# EAGLE schematic rockshield-standard (EAGLE 5.02)
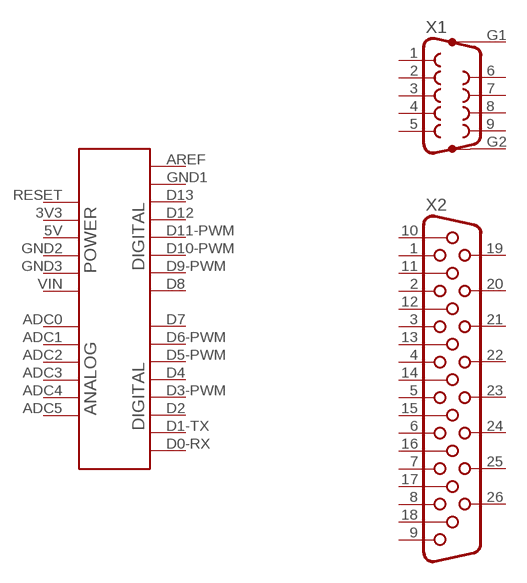
[diagram p0: schematic, sheet 1]

## Parts
U$1  2009  [2009]
X1  F09HP  [F09HP]
X2  HF26H  [HDF26H]
Unconnected: U$1.3V3 U$1.5V U$1.ADC0 U$1.ADC1 U$1.ADC2 U$1.ADC3 U$1.ADC4 U$1.ADC5 U$1.AREF U$1.D0-RX(D0) U$1.D1-TX(D1) U$1.D2 U$1.D3-PWM(D3) U$1.D4 U$1.D5-PWM(D5) U$1.D6-PWM(D6) U$1.D7 U$1.D8 U$1.D9-PWM(D9) U$1.D10-PWM(D10) U$1.D11-PWM(D11) U$1.D12 U$1.D13 U$1.GND1 U$1.GND2 U$1.GND3 U$1.RESET U$1.VIN X1.1 X1.2 X1.3 X1.4 X1.5 X1.6 X1.7 X1.8 X1.9 X1.G1 X1.G2 X2.1 X2.2 X2.3 X2.4 X2.5 X2.6 X2.7 X2.8 X2.9 X2.10 X2.11 X2.12 X2.13 X2.14 X2.15 X2.16 X2.17 X2.18 X2.19 X2.20 X2.21 X2.22 X2.23 X2.24 X2.25 X2.26

## Library data of the parts
U$1 = arduino-shields:2009
X1 = con-subd:F09HP: SUB-D
X2 = con-subd:HF26: SUB-D